# EAGLE schematic pinball-shield-2016-v1 (EAGLE 7.5.0)
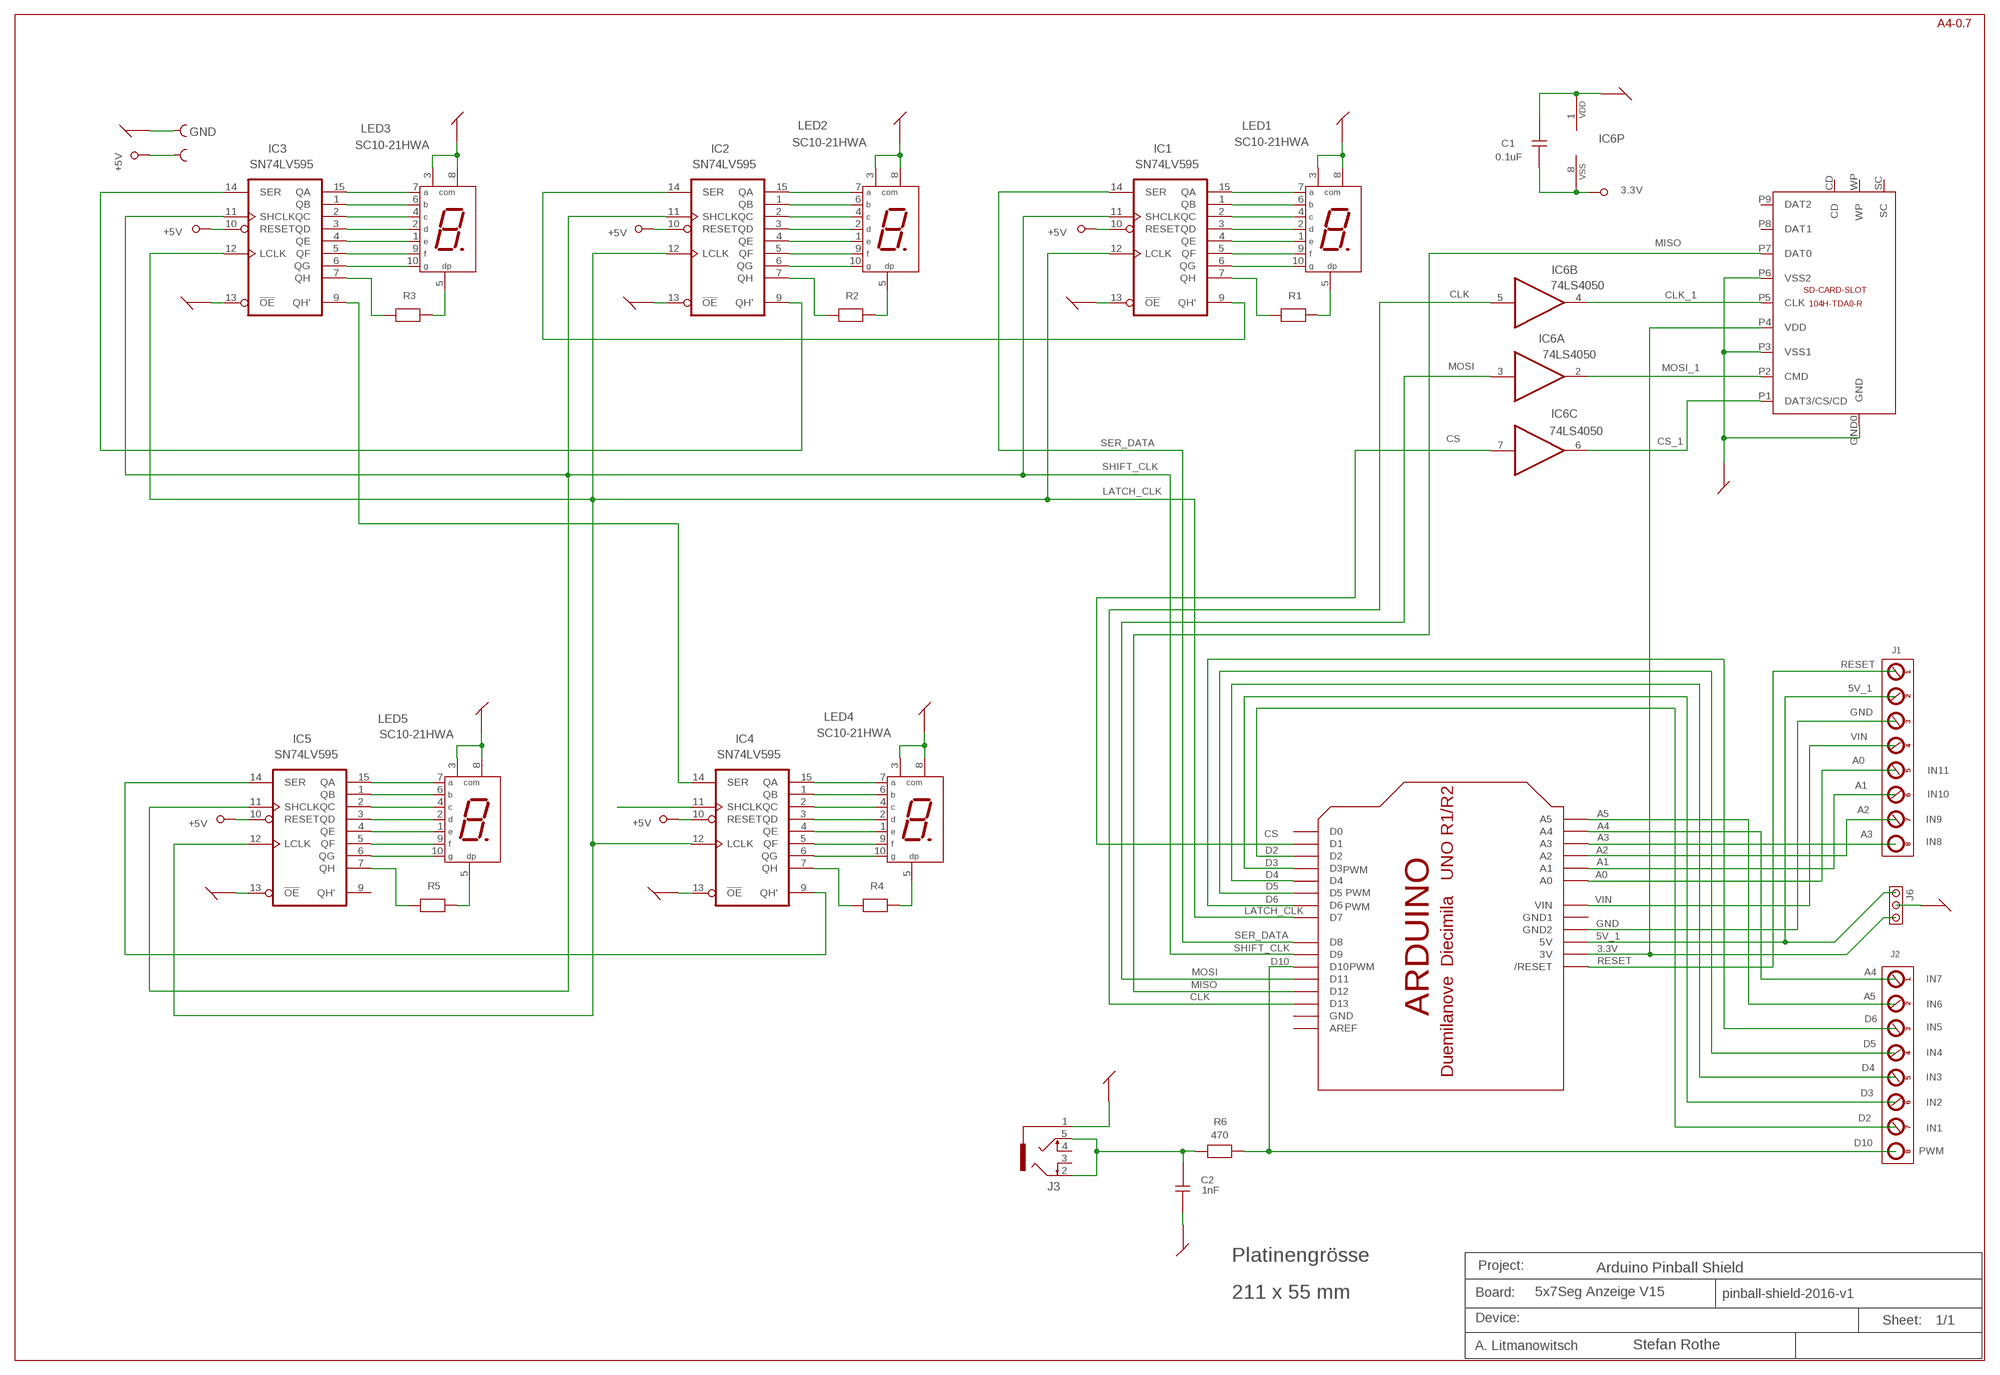
[diagram p0: schematic, sheet 1]

## Parts
C1  0.1uF  KP2,5-B  [02P101QK]
C2  1nF  KP2,5-B  [02P101QK]
IC1  SN74LV595  74595  [DIL16]
IC2  SN74LV595  74595  [DIL16]
IC3  SN74LV595  74595  [DIL16]
IC4  SN74LV595  74595  [DIL16]
IC5  SN74LV595  74595  [DIL16]
IC6  74LS4050  4050  [DIL16]
J1  CON08SCREW  [PH2_54X8]
J2  CON08SCREW  [PH2_54X8]
J3  JACK_3.5_STEREO_SWICH_CONRAD_730294  [JACK_CONRAD_730294]
J4  GND  CON01_FOR_AT2560_ALIT  [CON01_FOR_AT2560_ALIT]
J5  CON01_FOR_AT2560_ALIT  [CON01_FOR_AT2560_ALIT]
J6  CON03X1  [CON03X1]
LED1  SC10-21HWA  7SEG-25_4  [7SEG-2.54]
LED2  SC10-21HWA  7SEG-25_4  [7SEG-2.54]
LED3  SC10-21HWA  7SEG-25_4  [7SEG-2.54]
LED4  SC10-21HWA  7SEG-25_4  [7SEG-2.54]
LED5  SC10-21HWA  7SEG-25_4  [7SEG-2.54]
R1  RES02  [*2P200IL]
R2  RES02  [*2P200IL]
R3  RES02  [*2P200IL]
R4  RES02  [*2P200IL]
R5  RES02  [*2P200IL]
R6  470  RES02  [*2P200IL]
U$1  104H-TDA0-R  [104H-TDA0-R]
U$2  ARDUINO-NODIM  [ARDUINO-NODIM]

## Nets
3.3V: J6.3 U$1.P4(VDD) U$2.3V
5V_1: J1.2 J6.1 U$2.5V
+3.3V: C1.1 IC6.8(P:VSS) ; supply symbol labelled 3.3V
+5V: IC1.10(RESET) IC2.10(RESET) IC3.10(RESET) IC4.10(RESET) IC5.10(RESET) J5.1
A0: J1.5 U$2.A0
A1: J1.6 U$2.A1
A2: J1.7 U$2.A2
A3: J1.8 U$2.A3
A4: J2.1 U$2.A4
A5: J2.2 U$2.A5
CLK: IC6.5(B:I) U$2.D13
CLK_1: IC6.4(B:O) U$1.P5(CLK)
CS: IC6.7(C:I) U$2.D1
CS_1: IC6.6(C:O) U$1.P1(DAT3/CS/CD)
D2: J2.7 U$2.D2
D3: J2.6 U$2.D3
D4: J2.5 U$2.D4
D5: J2.4 U$2.D5
D6: J2.3 U$2.D6
D10: J2.8 R6.2 U$2.D10
GND: C1.2 C2.1 IC1.13(!OE) IC2.13(!OE) IC3.13(!OE) IC4.13(!OE) IC5.13(!OE) IC6.1(P:VDD) J1.3 J3.1 J4.1 J6.2 LED1.3(COM1) LED1.8(COM2) LED2.3(COM1) LED2.8(COM2) LED3.3(COM1) LED3.8(COM2) LED4.3(COM1) LED4.8(COM2) LED5.3(COM1) LED5.8(COM2) U$1.GND0(GND) U$1.P3(VSS1) U$1.P6(VSS2) U$2.GND2
LATCH_CLK: IC1.12(LCLK) IC2.12(LCLK) IC3.12(LCLK) IC4.12(LCLK) IC5.12(LCLK) U$2.D7
MISO: U$1.P7(DAT0) U$2.D12
MOSI: IC6.3(A:I) U$2.D11
MOSI_1: IC6.2(A:O) U$1.P2(CMD)
N$1: IC1.15(QA) LED1.7(A)
N$2: IC1.1(QB) LED1.6(B)
N$3: IC1.2(QC) LED1.4(C)
N$4: IC1.3(QD) LED1.2(D)
N$5: IC1.4(QE) LED1.1(E)
N$6: IC1.5(QF) LED1.9(F)
N$7: IC1.6(QG) LED1.10(G)
N$8: IC1.7(QH) R1.1
N$9: LED1.5(DP) R1.2
N$10: IC5.15(QA) LED5.7(A)
N$11: IC2.15(QA) LED2.7(A)
N$12: IC2.1(QB) LED2.6(B)
N$13: IC2.2(QC) LED2.4(C)
N$14: IC2.3(QD) LED2.2(D)
N$15: IC2.4(QE) LED2.1(E)
N$16: IC2.5(QF) LED2.9(F)
N$17: IC2.6(QG) LED2.10(G)
N$18: IC2.7(QH) R2.1
N$19: LED2.5(DP) R2.2
N$20: IC3.15(QA) LED3.7(A)
N$21: IC3.1(QB) LED3.6(B)
N$22: IC3.2(QC) LED3.4(C)
N$23: IC3.3(QD) LED3.2(D)
N$24: IC3.4(QE) LED3.1(E)
N$25: IC3.5(QF) LED3.9(F)
N$26: IC3.6(QG) LED3.10(G)
N$27: IC3.7(QH) R3.1
N$28: LED3.5(DP) R3.2
N$29: IC4.15(QA) LED4.7(A)
N$30: IC4.1(QB) LED4.6(B)
N$31: IC4.2(QC) LED4.4(C)
N$32: IC4.3(QD) LED4.2(D)
N$33: IC4.4(QE) LED4.1(E)
N$34: IC4.5(QF) LED4.9(F)
N$35: IC4.6(QG) LED4.10(G)
N$36: IC4.7(QH) R4.1
N$37: LED4.5(DP) R4.2
N$38: IC5.1(QB) LED5.6(B)
N$39: IC5.2(QC) LED5.4(C)
N$40: IC5.3(QD) LED5.2(D)
N$41: IC5.4(QE) LED5.1(E)
N$42: IC5.5(QF) LED5.9(F)
N$43: IC5.6(QG) LED5.10(G)
N$44: IC5.7(QH) R5.1
N$45: LED5.5(DP) R5.2
N$46: C2.2 J3.2 J3.5 R6.1
N$49: IC4.11(SHCLK)
RESET: J1.1 U$2.RESET(/RESET)
SER-DATA3: IC2.9(QH') IC3.14(SER)
SER_DATA: IC1.14(SER) U$2.D8
SER_DATA1: IC4.9(QH') IC5.14(SER)
SER_DATA2: IC1.9(QH') IC2.14(SER)
SER_DATA4: IC3.9(QH') IC4.14(SER)
SHIFT_CLK: IC1.11(SHCLK) IC2.11(SHCLK) IC3.11(SHCLK) IC5.11(SHCLK) U$2.D9
VIN: J1.4 U$2.VIN
Unconnected: IC5.9(QH') IC6.9(D:I) IC6.10(D:O) IC6.11(E:I) IC6.12(E:O) IC6.14(F:I) IC6.15(F:O) J3.3 J3.4 U$1.CD U$1.P8(DAT1) U$1.P9(DAT2) U$1.SC U$1.WP U$2.AREF U$2.D0

## Notes on the sheet
- IN11
- IN10
- IN9
- IN8
- PWM
- PWM
- PWM
- PWM
- IN7
- IN6
- IN5
- IN4
- IN3
- IN2
- IN1
- PWM
- Platinengrösse
- Arduino Pinball Shield
- 211 x 55 mm | 5x7Seg Anzeige V15
- Stefan Rothe

## Power pins joined to a net without a drawn wire
GND: IC1.8(GND) IC2.8(GND) IC3.8(GND) IC4.8(GND) IC5.8(GND) U$2.GND
GND1: U$2.GND1
VCC: IC1.16(VCC) IC2.16(VCC) IC3.16(VCC) IC4.16(VCC) IC5.16(VCC)

## Library data of the parts
C1 C2 = DISCRETE:KP2,5-B
IC1-IC5 = 74XX:74595
IC6 = 40XX:4050
J1 J2 = CONNEC:CON08SCREW
J3 = CONNEC:JACK_3.5_STEREO_SWICH_CONRAD_730294: A.Lit. 2015
J4 J5 = CONNEC:CON01_FOR_AT2560_ALIT
J6 = CONNEC:CON03X1
LED1-LED5 = DISP:7SEG-25_4
R1-R6 = DISCRETE:RES02*
U$1 = con-sd-attend2:104H-TDA0-R: A.Lit 2015
U$2 = adafruit:ARDUINO: Arduino Diecimila/Duemilanove Make a shield with ease, this package has all the named pins as well as the two mounting drill holes and an outline of the USB and DC power connector. The outline is on the DIMENSION layer, so if your board house uses it they will cut the outline to match. http://www.ladyada.net/library/pcb/eaglelibrary.html